# EAGLE schematic Cube Schematic (EAGLE 6.4)
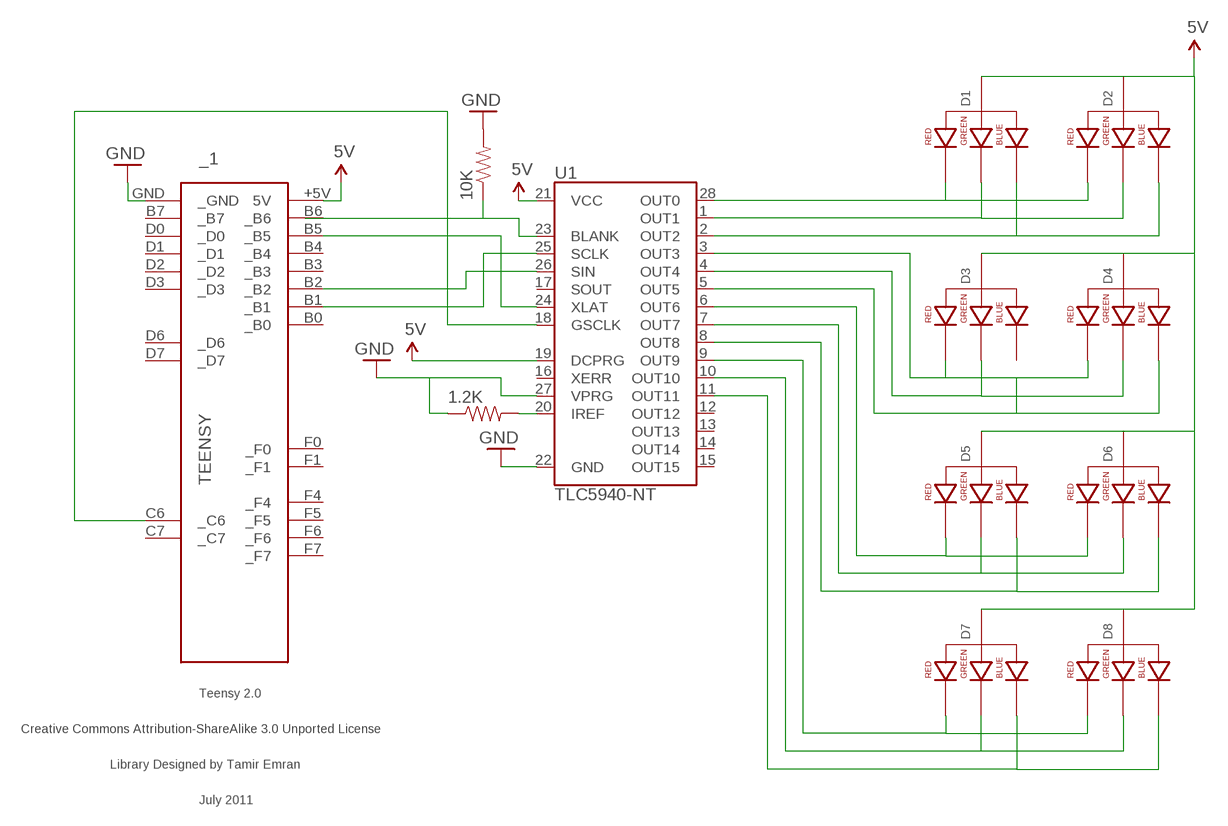
[diagram p0: schematic, sheet 1]

## Parts
1.2K  RESISTOREZ  [AXIAL-0.3EZ]
10K  RESISTOREZ  [AXIAL-0.3EZ]
_1  TEENSY  [TEENSY]
D1  LED-RGB-CA-THRUDIFFUSE  [LED-RGB-THRU]
D2  LED-RGB-CA-THRUDIFFUSE  [LED-RGB-THRU]
D3  LED-RGB-CA-THRUDIFFUSE  [LED-RGB-THRU]
D4  LED-RGB-CA-THRUDIFFUSE  [LED-RGB-THRU]
D5  LED-RGB-CA-THRUDIFFUSE  [LED-RGB-THRU]
D6  LED-RGB-CA-THRUDIFFUSE  [LED-RGB-THRU]
D7  LED-RGB-CA-THRUDIFFUSE  [LED-RGB-THRU]
D8  LED-RGB-CA-THRUDIFFUSE  [LED-RGB-THRU]
U1  TLC5940-NT  [DIL28-3]

## Nets
5V: _1.+5V(5V) D1.2(ANODE) D2.2(ANODE) D3.2(ANODE) D4.2(ANODE) D5.2(ANODE) D6.2(ANODE) D7.2(ANODE) D8.2(ANODE) U1.19(DCPRG) U1.21(VCC)
GND: 1.2K.P$1 10K.P$2 _1.GND(_GND) U1.22(GND) U1.27(VPRG)
N$1: D1.1(RED_CATHODE) D2.1(RED_CATHODE) U1.28(OUT0)
N$2: D1.3(GREEN_CATHODE) D2.3(GREEN_CATHODE) U1.1(OUT1)
N$3: D1.4(BLUE_CATHODE) D2.4(BLUE_CATHODE) U1.2(OUT2)
N$4: D3.1(RED_CATHODE) D4.1(RED_CATHODE) D4.4(BLUE_CATHODE) U1.3(OUT3) U1.5(OUT5)
N$5: D3.3(GREEN_CATHODE) D4.3(GREEN_CATHODE) U1.4(OUT4)
N$6: D5.1(RED_CATHODE) D6.1(RED_CATHODE) U1.6(OUT6)
N$8: D5.3(GREEN_CATHODE) D6.3(GREEN_CATHODE) U1.7(OUT7)
N$9: D5.4(BLUE_CATHODE) D6.4(BLUE_CATHODE) U1.8(OUT8)
N$10: D7.1(RED_CATHODE) D8.1(RED_CATHODE) U1.9(OUT9)
N$11: D7.3(GREEN_CATHODE) D8.3(GREEN_CATHODE) U1.10(OUT10)
N$12: D7.4(BLUE_CATHODE) D8.4(BLUE_CATHODE) U1.11(OUT11)
N$13: 10K.P$1 U1.23(BLANK)
N$14: _1.B1(_B1) U1.25(SCLK)
N$15: _1.B2(_B2) U1.26(SIN)
N$16: _1.B5(_B5) U1.24(XLAT)
N$17: _1.C6(_C6) U1.18(GSCLK)
N$19: 1.2K.P$2 U1.20(IREF)
Unconnected: _1.B0(_B0) _1.B3(_B3) _1.B4(_B4) _1.B6(_B6) _1.B7(_B7) _1.C7(_C7) _1.D0(_D0) _1.D1(_D1) _1.D2(_D2) _1.D3(_D3) _1.D6(_D6) _1.D7(_D7) _1.F0(_F0) _1.F1(_F1) _1.F4(_F4) _1.F5(_F5) _1.F6(_F6) _1.F7(_F7) D3.4(BLUE_CATHODE) U1.12(OUT12) U1.13(OUT13) U1.14(OUT14) U1.15(OUT15) U1.16(XERR) U1.17(SOUT)

## Library data of the parts
1.2K 10K = SparkFun-Passives:RESISTOR: Resistor Basic schematic elements and footprints for 0603, 1206, and PTH resistors.
_1 = teensy:TEENSY: Teensy 2.0 Original Design by Clint Fisher Modified Design by Tamir Emran Licensed Under Creative Commons Attribution-ShareAlike 3.0 Unported (CC BY-SA 3.0)
D1-D8 = SparkFun-LED:LED-RGB-CA-THRU: RGB Through-hole common anode SparkFun store front COM-10821 (diffuse) COM-10820 (clear); PROD_ID: DIO-10632
U1 = SparkFun-DigitalIC:TLC5940: 16-channel LED Driver with Dot Correction and Grayscale PWM Control The TLC5940 is a 16-channel, constant-current sink LED driver. Each channel has an individually adjustable 4096-step grayscale PWM brightness control and a 64-step, constant-current sink (dot correction). The dot correction adjusts the brightness variations between LED channels and other LED drivers. The dot correction data is stored in an integrated EEPROM. Both grayscale control and dot correction are accessible via a serial interface. A single external resistor sets the maximum current value of all 16 channels. Packages: 28-pin HTSSOP 32-pin 5x5mm QFN 28-pin DIP